# EAGLE schematic ps_adjustable_hv (EAGLE 9.4.2)
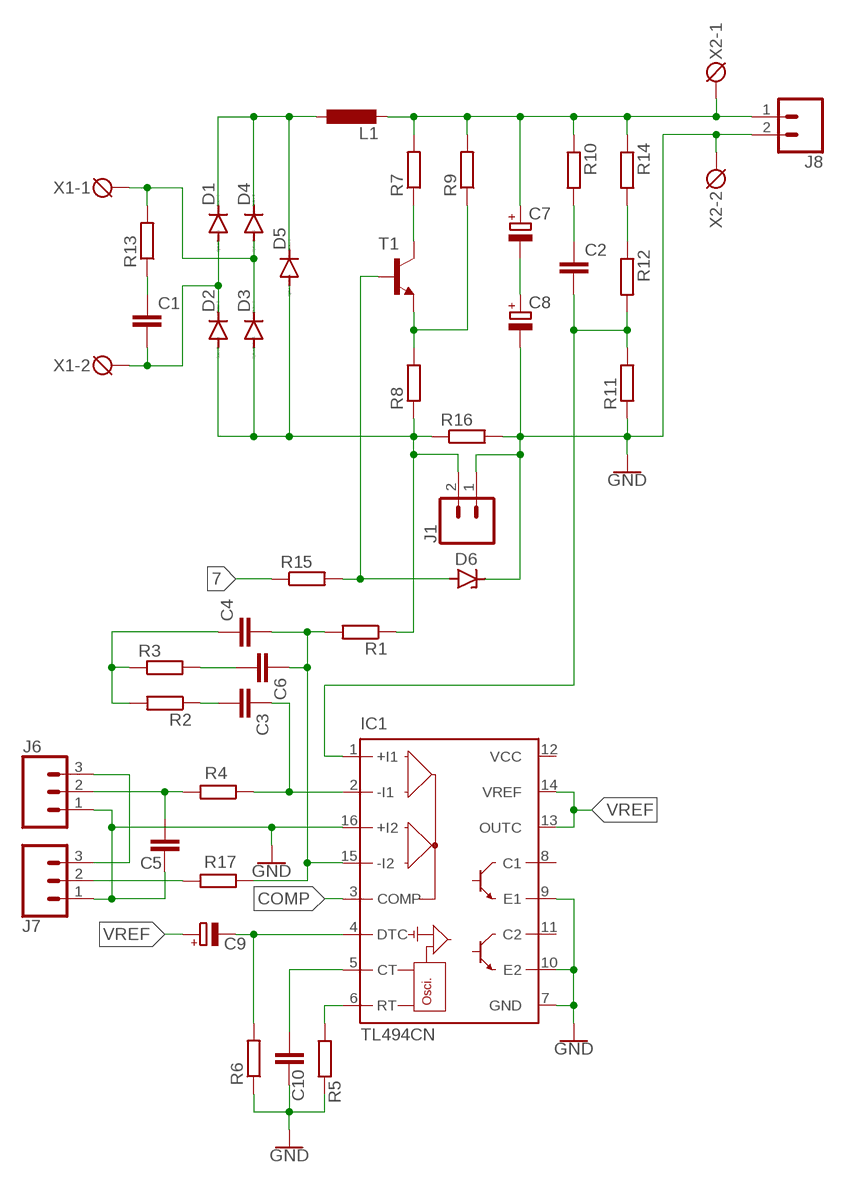
[diagram p0: schematic, sheet 1]

## Parts
C1  C-EU050-045X075  [C050-045X075]
C2  C-EU102-064X133  [C102-064X133]
C3  C-EUC0805  [C0805]
C4  C-EUC0805  [C0805]
C5  C-EUC0805  [C0805]
C6  C-EUC0805  [C0805]
C7  CPOL-EUE10-20  [EB20D]
C8  CPOL-EUE10-20  [EB20D]
C9  CPOL-EUE2.5-6  [E2,5-6]
C10  C-EUC0805  [C0805]
D1  UF4003  [DO41-10]
D2  UF4003  [DO41-10]
D3  UF4003  [DO41-10]
D4  UF4003  [DO41-10]
D5  UF4003  [DO41-10]
D6  ZENER-DIODEP1-Z12  [P1Z12]
IC1  TL494CN  [DIL16]
J1  CONN_02  [1X02]
J6  455-1750-1-ND  CONN_03  [1X03]
J7  455-1750-1-ND  CONN_03  [1X03]
J8  CONN_02  [1X02]
L1  L-EUTJ5-U1  [TJ5-U1]
R1  R-EU_R0805  [R0805]
R2  R-EU_R0805  [R0805]
R3  R-EU_VMTA55  [VMTA55]
R4  R-EU_VMTA55  [VMTA55]
R5  R-EU_R0805  [R0805]
R6  R-EU_R0805  [R0805]
R7  R-EU_VMTA55  [VMTA55]
R8  R-EU_VMTA55  [VMTA55]
R9  R-EU_VMTA55  [VMTA55]
R10  R-EU_VMTA55  [VMTA55]
R11  R-EU_VMTA55  [VMTA55]
R12  R-EU_VMTA55  [VMTA55]
R13  R-EU_VMTB60  [VMTB60]
R14  R-EU_VTA53  [VTA53]
R15  R-EU_VMTA55  [VMTA55]
R16  R-EU_VTA53  [VTA53]
R17  R-EU_VMTA55  [VMTA55]
T1  2N6517-NPN-TO92-CBE  [TO92-CBE]
X1  DG3XX-02-5.0  [DG306-5.0-02P]
X2  DG3XX-02-5.0  [DG306-5.0-02P]

## Nets
2: J6.3 J7.3
7: R15.1
9: C2.2 IC1.1(+I1) R11.2 R12.2
COMP: IC1.3(COMP)
GND: C5.2 C8.- C10.1 D6.C IC1.7(GND) IC1.9(E1) IC1.10(E2) IC1.16(+I2) J1.1 J6.1 J7.1 J8.2 R5.2 R6.1 R11.1 R16.2 X2.2
N$1: C9.- IC1.4(DTC) R6.2
N$2: C1.1 R13.1
N$3: C1.2 D1.A D2.C X1.2
N$4: D3.C D4.A R13.2 X1.1
N$5: D2.A D3.A D5.A J1.2 R1.1 R8.1 R16.1
N$6: R7.1 T1.C
N$7: R8.2 R9.1 T1.E
N$8: C7.+ J8.1 L1.2 R7.2 R9.2 R10.1 R14.1 X2.1
N$9: D1.C D4.C D5.C L1.1
N$10: C2.1 R10.2
N$11: R12.1 R14.2
N$12: IC1.6(RT) R5.1
N$13: C7.- C8.+
N$14: C10.2 IC1.5(CT)
N$15: D6.A R15.2 T1.B
N$18: C4.1 R2.2 R3.1
N$19: C3.1 IC1.2(-I1) R4.1
N$20: C4.2 C6.1 IC1.15(-I2) R1.2 R17.1
N$21: C5.1 J6.2 R4.2
N$22: C6.2 R3.2
N$23: J7.2 R17.2
N$25: C3.2 R2.1
VREF: C9.+ IC1.13(OUTC) IC1.14(VREF)
Unconnected: IC1.8(C1) IC1.11(C2)

## Power pins joined to a net without a drawn wire
VCC: IC1.12(VCC)

## Library data of the parts
C1 C2 = rcl_modify:C-EU: CAPACITOR, European symbol; SPICEPREFIX: C
C3-C6 C10 = rcl:C-EU: CAPACITOR, European symbol; SPICEPREFIX: C
C7-C9 = rcl:CPOL-EU: POLARIZED CAPACITOR, European symbol; SPICEPREFIX: C
D1-D5 = diode_modify:UF4003: DIODE ultrafast recovery diode, 200 V rectifier
D6 = diode:ZENER-DIODE: Z-Diode
IC1 = linear:TL494*: SWITCHMODE Pulse Width Modulation Control Circuit NCV494B http://onsemi.com tl494-d.pdf
J1 J8 = SparkFun-Connectors:CONN_02: Multi connection point. Often used as Generic Header-pin footprint for 0.1 inch spaced/style header connections On any of the 0.1 inch spaced packages, you can populate with these: Break Away Headers - Straight <https://www.sparkfun.com/products/116> (PRT-00116) Break Away Male Headers - Right Angle <https://www.sparkfun.com/products/553> (PRT-00553) Female Headers <https://www.sparkfun.com/products/115> (PRT-00115) Break Away Headers - Machine Pin <https://www.sparkfun.com/products/117> (PRT-00117) Break Away Female Headers - Swiss Machine Pin <https://www.sparkfun.com/products/743> (PRT-00743) For SCREWTERMINALS and SPRING TERMINALS visit here: Screw Terimnals on SparkFun.com <https://www.sparkfun.com/search/results?term=Screw+Terminals> (5mm/3.5mm/2.54mm spacing) This device is also useful as a general connection point to wire up your design to another part of your project. Our various solder wires solder well into these plated through hole pads. Hook-Up Wire - Assortment (Stranded, 22 AWG) <https://www.sparkfun.com/products/11375> (PRT-11375) Hook-Up Wire - Assortment (Solid Core, 22 AWG) <https://www.sparkfun.com/products/11367> (PRT-11367) View the entire wire category on our website here <https://www.sparkfun.com/categories/141> Special notes: Molex polarized connector foot print use with: PRT-08233 with associated crimp pins and housings. 2.54_SCREWTERM for use with PRT-10571. 3.5mm Screw Terminal footprints for PRT-08084 5mm Screw Terminal footprints for use with PRT-08432
J6 J7 = SparkFun-Connectors:CONN_03: Multi connection point. Often used as Generic Header-pin footprint for 0.1 inch spaced/style header connections On any of the 0.1 inch spaced packages, you can populate with these: Break Away Headers - Straight <https://www.sparkfun.com/products/116> (PRT-00116) Break Away Male Headers - Right Angle <https://www.sparkfun.com/products/553> (PRT-00553) Female Headers <https://www.sparkfun.com/products/115> (PRT-00115) Break Away Headers - Machine Pin <https://www.sparkfun.com/products/117> (PRT-00117) Break Away Female Headers - Swiss Machine Pin <https://www.sparkfun.com/products/743> (PRT-00743) Stackable Header - 3 Pin (Female, 0.1") <https://www.sparkfun.com/products/13875> (PRT-13875) For SCREWTERMINALS and SPRING TERMINALS visit here: Screw Terimnals on SparkFun.com <https://www.sparkfun.com/search/results?term=Screw+Terminals> (5mm/3.5mm/2.54mm spacing) This device is also useful as a general connection point to wire up your design to another part of your project. Our various solder wires solder well into these plated through hole pads. Hook-Up Wire - Assortment (Stranded, 22 AWG) <https://www.sparkfun.com/products/11375> (PRT-11375) Hook-Up Wire - Assortment (Solid Core, 22 AWG) <https://www.sparkfun.com/products/11367> (PRT-11367) View the entire wire category on our website here <https://www.sparkfun.com/categories/141> Special notes: Molex polarized connector foot print use with SKU : PRT-08232 with associated crimp pins and housings.; PROD_ID: XXX-00000
L1 = rcl_modify:L-EU: INDUCTOR, European symbol; SPICEPREFIX: L
R1 R2 R5 R6 = rcl:R-EU_: RESISTOR, European symbol; SPICEPREFIX: R
R3 R4 R7-R17 = rcl_modify:R-EU_: RESISTOR, European symbol; SPICEPREFIX: R
T1 = transistor_modify:*-NPN-: NPN Transistror BF959 corrected 2008.03.06
X1 X2 = degson:DG3XX-02: DG350-3.5-02P DG306-5.0-02P